# EAGLE design WS2812B-compact (EAGLE 6.6.0)
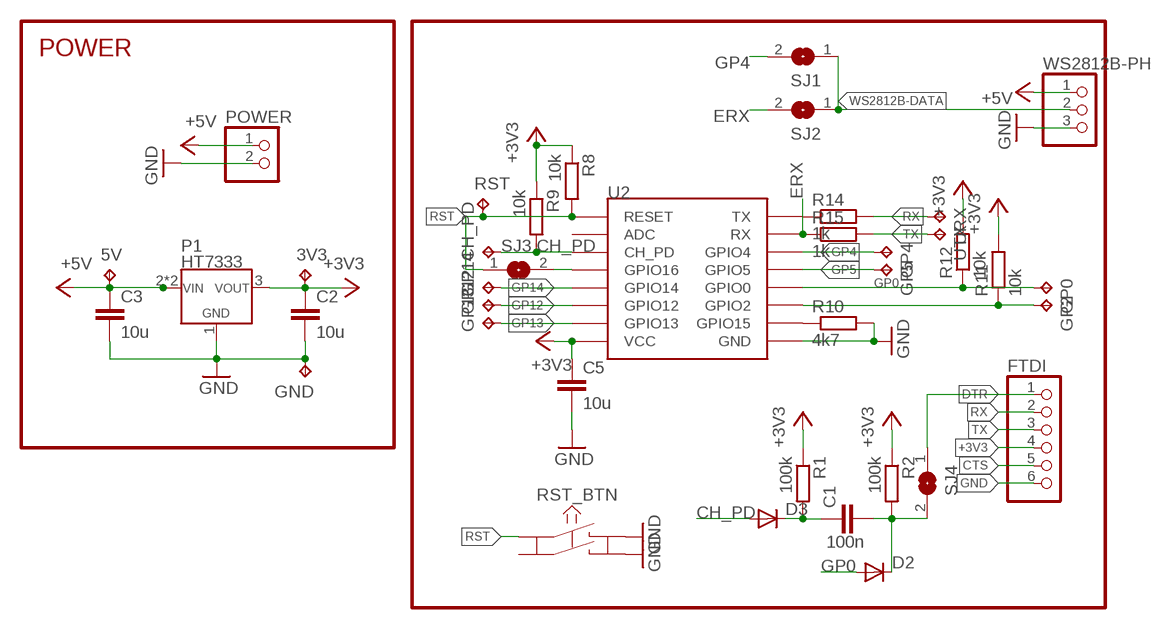
[diagram p0: schematic, sheet 1]

## Parts
3V3  TPB2,54  [B2,54]
5V  TPB2,54  [B2,54]
C1  100n  C-EUC1206  [C1206]
C2  10u  C-EUC1206  [C1206]
C3  10u  C-EUC1206  [C1206]
C5  10u  C-EUC1206  [C1206]
CH_PD  TPB1,27  [B1,27]
D2  DIODE-MINIMELF  [MINIMELF]
D3  DIODE-MINIMELF  [MINIMELF]
FTDI  PINHD-1X06_2.54-S  [1X06-S]
GND  TPB2,54  [B2,54]
GP0  TPB1,27  [B1,27]
GP2  TPB1,27  [B1,27]
GP4  TPB1,27  [B1,27]
GP5  TPB1,27  [B1,27]
GP12  TPB1,27  [B1,27]
GP13  TPB1,27  [B1,27]
GP14  TPB1,27  [B1,27]
P1  HT7333  [SOT223]
POWER  PINHD-1X2  [1X02]
R1  100k  R-EU_R0805  [R0805]
R2  100k  R-EU_R0805  [R0805]
R8  10k  R-EU_R0805  [R0805]
R9  10k  R-EU_R0805  [R0805]
R10  4k7  R-EU_R0805  [R0805]
R11  10k  R-EU_R0805  [R0805]
R12  10k  R-EU_R0805  [R0805]
R14  1k  R-EU_R0805  [R0805]
R15  1k  R-EU_R0805  [R0805]
RST  TPB1,27  [B1,27]
RST_BTN  KSM611A  [KSM611A]
SJ1  SJ  [SJ]
SJ2  SJ  [SJ]
SJ3  SJ  [SJ]
SJ4  SJ  [SJ]
U2  ESP12SMD  [ESP12-SMD]
URX  TPB1,27  [B1,27]
UTX  TPB1,27  [B1,27]
WS2812B-PH  PINHD-1X03_2.54-S  [1X03-S]

## Nets
+3V3: 3V3.TP C2.1 C5.1 FTDI.4 P1.3(VOUT) R1.1 R2.1 R8.1 R9.1 R11.2 R12.2 U2.VCC
+5V: 5V.TP C3.1 P1.2(VIN) P1.4(VIN) POWER.1 WS2812B-PH.1
CH_PD: CH_PD.TP D3.A R9.2 U2.CH_PD
CTS: FTDI.5
DTR: FTDI.1 SJ4.1
ERX: R15.1 SJ2.2 U2.RXD0(RX)
GND: C2.2 C3.2 C5.2 FTDI.6 GND.TP P1.1(GND) POWER.2 R10.2 RST_BTN.B RST_BTN.D U2.GND WS2812B-PH.3
GP0: D2.A GP0.TP R12.1 U2.GPIO0
GP4: GP4.TP SJ1.2 U2.GPIO4
GP5: GP5.TP U2.GPIO5
GP12: GP12.TP U2.GPIO12
GP13: GP13.TP U2.GPIO13
GP14: GP14.TP U2.GPIO14
N$2: C1.2 D2.C R2.2 SJ4.2
N$3: C1.1 D3.C R1.2
N$4: R10.1 U2.GPIO15
N$5: GP2.TP R11.1 U2.GPIO2
N$6: SJ3.2 U2.GPIO16
N$7: R14.1 U2.TXD0(TX)
RST: R8.2 RST.TP RST_BTN.A SJ3.1 U2.RESET
RX: FTDI.2 R14.2 URX.TP
TX: FTDI.3 R15.2 UTX.TP
WS2812B-DATA: SJ1.1 SJ2.1 WS2812B-PH.2
Unconnected: RST_BTN.C U2.ADC

## Notes on the sheet
- POWER

## Library data of the parts
3V3 5V CH_PD GND GP0 GP2 GP4 GP5 GP12-GP14 RST URX UTX = testpad:TP: Test pad
C1-C3 C5 = rcl:C-EU: CAPACITOR, European symbol
D2 D3 = diode:DIODE-: DIODE
FTDI = pinhead-2:PINHD-1X06: PIN HEADER
P1 = diyHue:HT7333
POWER = pinhead:PINHD-1X2: PIN HEADER
R1 R2 R8-R12 R14 R15 = rcl:R-EU_: RESISTOR, European symbol
RST_BTN = schalter_taster:KSM611A
SJ1-SJ4 = jumper:SJ: SMD solder JUMPER
U2 = esp8266modules:ESP12: ESP8266 Wifi module 12
WS2812B-PH = pinhead-2:PINHD-1X03: PIN HEADER

## Net classes
0 default: clearance 0.127 mm

## Board
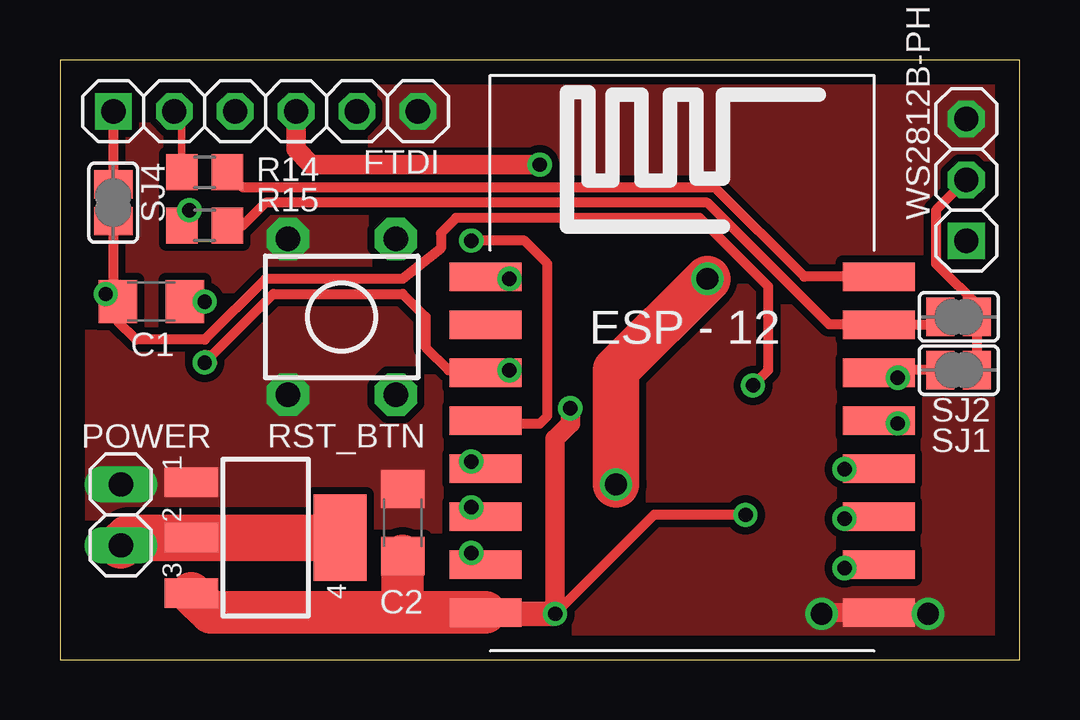
[diagram p1: board, top side]
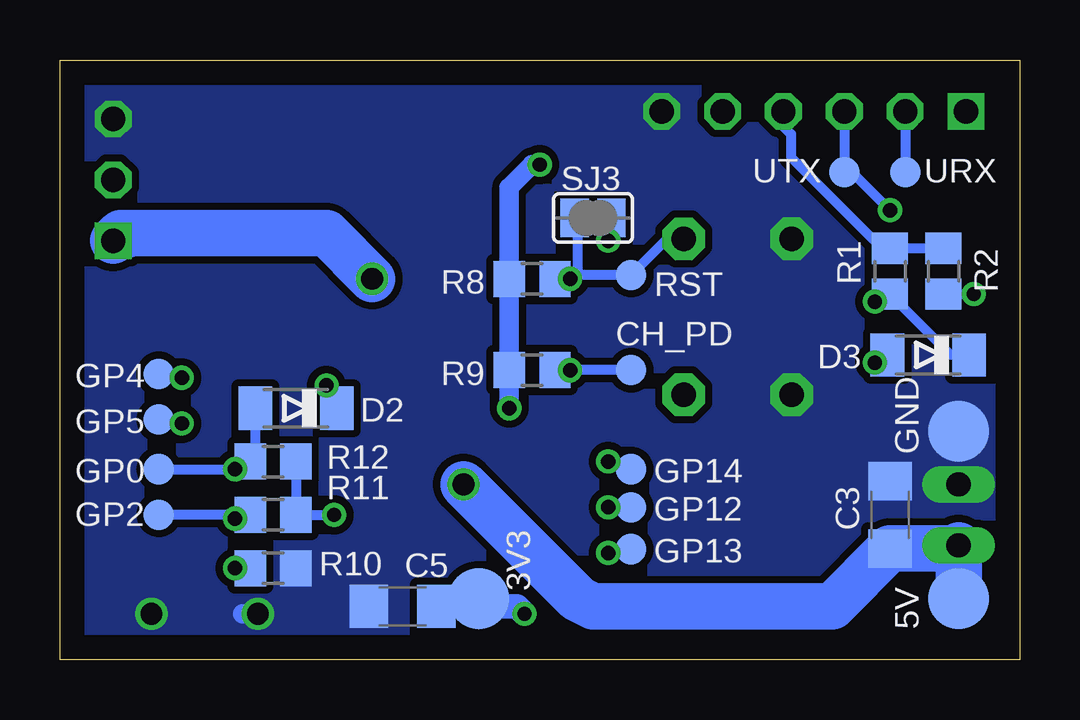
[diagram p2: board, bottom side, seen from below]

Size 40 x 25 mm. Coordinates in mm from the lower left corner, seen from the top.
Outline: 0,0 40,0 40,25 0,25 0,0
Copper layers (1*16): Top 0.035mm / dielectric 1.5mm / Bottom 0.035mm
Design rules "default *": minimum track width 10mil, minimum drill 19mil, track to track 8mil, track to pad 8mil, pad to pad 8mil, via to via 8mil, smd to smd 0mil, copper to edge 40mil, drill to drill 8mil, minimum pad ring 10mil, minimum via ring 8mil, stop-mask expansion 4mil, vias tented up to drill 0mil, thermal gap 10mil

### Footprints (pad centres in the part's own frame; a part is rotated, then mirrored left to right if it is on the bottom)
B2,54 = smd 2.54 x 2.54: TP 0,0
C1206 = smd 1.6 x 1.8: 1 -1.4,0; 2 1.4,0
B1,27 = smd 1.27 x 1.27: TP 0,0
MINIMELF = smd 1.4 x 1.8: A 1.7,0; C -1.7,0
1X06-S = drill 1.016 square: 1 -6.35,0 | drill 1.016 octagon: 2 -3.81,0; 3 -1.27,0; 4 1.27,0; 5 3.81,0; 6 6.35,0
SOT223 = smd 1.219 x 2.235: 1 -2.311,-3.099; 2 0,-3.099; 3 2.311,-3.099 | smd 3.6 x 2.2: 4 0,3.099
1X02 = drill 1.016 long: 1 -1.27,0; 2 1.27,0
R0805 = smd 1.3 x 1.5: 1 -0.95,0; 2 0.95,0
KSM611A = drill 1.016 pad 1.778 octagon: A -3.25,2.25; B -3.25,-2.25; C 3.25,2.25; D 3.25,-2.25
SJ = smd 1.168 x 1.6: 1 -0.762,0; 2 0.762,0
ESP12-SMD = smd 3 x 1.2: ADC -8.3,3.8; CH_PD -8.3,1.8; GND 8.1,-8.2; GPIO0 8.1,-2.2; GPIO2 8.1,-4.2; GPIO4 8.1,1.8; GPIO5 8.1,-0.2; GPIO12 -8.3,-4.2; GPIO13 -8.3,-6.2; GPIO14 -8.3,-2.2; GPIO15 8.1,-6.2; GPIO16 -8.3,-0.2; RESET -8.3,5.8; RXD0 8.1,3.8; TXD0 8.1,5.8; VCC -8.3,-8.2
1X03-S = drill 1.016 square: 1 -2.54,0 | drill 1.016 octagon: 2 0,0; 3 2.54,0

### Placement (x,y rotation side)
3V3  22.54,2.54 90 bottom
5V  2.54,2.54 90 bottom
C1  3.81,14.92 180 top
C2  14.29,5.71 90 top
C3  5.4,6.03 90 bottom
C5  25.72,2.22 180 bottom
CH_PD  16.19,12.06 0 bottom
D2  30.16,10.48 180 bottom
D3  3.81,12.7 180 bottom
FTDI  8.57,22.86 0 top
GND  2.54,9.53 90 bottom
GP0  35.88,7.94 0 bottom
GP2  35.88,6.03 0 bottom
GP4  35.88,11.91 0 bottom
GP5  35.88,10 0 bottom
GP12  16.19,6.35 0 bottom
GP13  16.19,4.6 0 bottom
GP14  16.19,7.94 0 bottom
P1  8.57,5.08 270 top
POWER  2.54,6.03 90 top
R1  5.4,16.19 270 bottom
R2  3.17,16.19 270 bottom
R8  20.32,15.88 0 bottom
R9  20.32,12.06 0 bottom
R10  31.11,3.81 0 bottom
R11  31.11,6.03 0 bottom
R12  31.11,8.26 0 bottom
R14  6.03,20.32 180 top
R15  6.03,18.1 180 top
RST  16.19,16.03 0 bottom
RST_BTN  11.75,14.29 270 top
SJ1  37.47,12.06 180 top
SJ2  37.47,14.29 180 top
SJ3  17.78,18.41 0 bottom
SJ4  2.22,19.05 270 top
U2  26.04,10.16 0 top
URX  4.76,20.32 180 bottom
UTX  7.3,20.32 180 bottom
WS2812B-PH  37.78,20 90 top

### Tracks (layer width: path | path; a pad name or v marks a point on that pad's centre or on a via)
+3V3  (via drill 0.6)
  Top 0.406: v28.57,6.03 24.77,6.03 v20.64,1.91
  Top 0.813: v20.64,1.91 20.64,9.21 21.27,9.84 v21.27,10.48 | v20,20.64 10.48,20.64 9.84,21.27 FTDI.4
  Top 1.016: v20.64,1.91 17.79,1.91 U2.VCC
  Top 1.778: U2.VCC 14.29,1.96 | 14.29,1.96 6.28,1.96 P1.3 | C2.1 14.29,1.96
  Bottom 0.406: R2.1 R1.1 5.71,17.14 9.53,20.95 9.53,21.91 9.84,22.23 FTDI.4 | R12.2 R11.2 30.48,6.03 30.16,5.71 29.84,6.03 v28.57,6.03
  Bottom 0.813: v21.27,10.48 R9.1 21.27,12.38 R8.1 21.27,16.19 21.27,19.68 20.32,20.64 v20,20.64
  Bottom 1.016: C5.1 22.54,2.22 | 3V3.TP 22.54,2.22 | 22.54,2.22 20.95,2.22 v20.64,1.91
+5V  (via drill 0.9)
  Top 1.93: P1.4 P1.2 2.86,5.08 POWER.1 | v23.18,7.3 23.18,12.06 v26.99,15.88
  Bottom 1.422: 37.15,17.46 WS2812B-PH.1
  Bottom 1.93: WS2812B-PH.1 37.47,17.78 28.89,17.78 v26.99,15.88 | 5V.TP POWER.1 2.67,4.63 C3.1 7.81,2.22 17.78,2.22 18.41,2.54 v23.18,7.3
CH_PD  (via drill 0.6)
  Top 0.406: U2.CH_PD 18.63,11.96 v18.73,12.06 | 6.35,12.38 v6.03,12.38 6.03,12.7 6.35,12.7 8.89,15.24 14.29,15.24 15.24,14.29 15.24,13.02 CH_PD.TP 17.46,12.06 U2.CH_PD | 17.63,12.06 U2.CH_PD
  Bottom 0.406: CH_PD.TP v18.73,12.06 R9.2 | D3.A 5.71,12.7 v6.03,12.38
DTR
  Top 0.406: FTDI.1 SJ4.1
ERX
  Top 0.406: SJ2.2 36.69,13.96 U2.RXD0 32.07,13.97 26.99,19.05 8.57,19.05 7.62,18.1 R15.1
GND  (via drill 0.9)
  Top 0.813: U2.GND 36.2,1.96 v36.2,1.91 31.8,1.96 v31.75,1.91
  Bottom 0.813: v31.75,1.91 32.38,1.91
  pour Bottom (isolate 0.305, no thermals): -4.45,26.67 50.8,26.67 50.8,-2.54 -4.45,-2.54
  pour Top (isolate 0.305, no thermals): -9.53,26.99 45.72,26.99 45.72,-2.22 -9.53,-2.22
GP0  (via drill 0.6)
  Top 0.406: U2.GPIO0 33.04,7.96 v32.7,7.94
  Bottom 0.406: GP0.TP v32.7,7.94 32.38,7.94 R12.1 31.86,8.46 D2.A
GP4  (via drill 0.6)
  Top 0.406: U2.GPIO4 34.35,11.75 v34.92,11.75 35.24,12.06 SJ1.2
  Bottom 0.406: GP4.TP 35.08,11.91 v34.92,11.75
GP5  (via drill 0.6)
  Top 0.406: v34.92,9.84 34.25,9.84 U2.GPIO5
  Bottom 0.406: GP5.TP 35.08,10 v34.92,9.84
GP12  (via drill 0.6)
  Top 0.406: v17.14,6.35 17.49,5.71 U2.GPIO12
  Bottom 0.406: GP12.TP v17.14,6.35
GP13  (via drill 0.6)
  Top 0.406: v17.14,4.45 17.59,3.81 U2.GPIO13
  Bottom 0.406: GP13.TP 16.99,4.6 v17.14,4.45
GP14  (via drill 0.6)
  Top 0.406: v17.14,8.26 17.71,7.94 U2.GPIO14
  Bottom 0.406: GP14.TP v17.14,8.26
N$2  (via drill 0.6)
  Top 0.406: SJ4.2 2.22,15.11 C1.2 | v1.91,15.24 2.09,15.24 C1.2 | v28.89,11.43 29.53,12.06 29.53,15.56 26.67,18.41 16.51,18.41 15.88,17.78 15.88,17.14 14.29,15.88 8.57,15.88 6.03,13.34 3.17,13.34 2.41,14.1 C1.2 | 2.54,14.92 C1.2
  Bottom 0.406: R2.2 v1.91,15.24 | v28.89,11.43 28.57,11.11 28.57,10.48 D2.C
N$3  (via drill 0.6)
  Top 0.406: C1.1 v6.03,14.92
  Bottom 0.406: D3.C 2.85,12.7 R1.2 5.72,14.92 v6.03,14.92
N$4  (via drill 0.6)
  Top 0.406: U2.GPIO15 32.85,3.96 v32.7,3.81
  Bottom 0.406: v32.7,3.81 R10.1
N$5  (via drill 0.6)
  Top 0.406: U2.GPIO2 34.52,5.96 v32.7,5.87
  Bottom 0.406: R11.1 32.06,5.87 v32.7,5.87 32.7,6.03 GP2.TP
N$6  (via drill 0.6)
  Top 0.406: v17.14,17.46 19.37,17.46 20.32,16.51 20.32,10.16 20,9.84 17.78,9.84 U2.GPIO16
  Bottom 0.406: v17.14,17.46 17.14,18.41 SJ3.2
N$7
  Top 0.406: U2.TXD0 31.03,15.96 27.3,19.68 7.62,19.68 R14.1
RST  (via drill 0.6)
  Top 0.406: U2.RESET 17.46,15.68 18.07,15.68 18.41,16.03 18.41,15.88 v18.73,15.88
  Bottom 0.406: 18.73,16.03 RST.TP 14.37,17.86 RST_BTN.A | 18.73,16.03 19.21,16.03 R8.2 | 18.73,16.03 v18.73,15.88 18.41,16.19 18.41,18.41 SJ3.1
RX
  Top 0.305: FTDI.2 5.08,22.54 R14.2
  Bottom 0.406: FTDI.2 URX.TP
TX  (via drill 0.6)
  Top 0.406: v5.4,18.73 5.4,18.41 R15.2
  Bottom 0.406: FTDI.3 UTX.TP 6.99,20.32 v5.4,18.73
WS2812B-DATA
  Top 0.406: SJ1.1 SJ2.1 38.42,14.29 38.42,14.61 36.51,16.51 36.51,18.73 WS2812B-PH.2